# EAGLE design Ver2.1 (EAGLE 9.6.2)
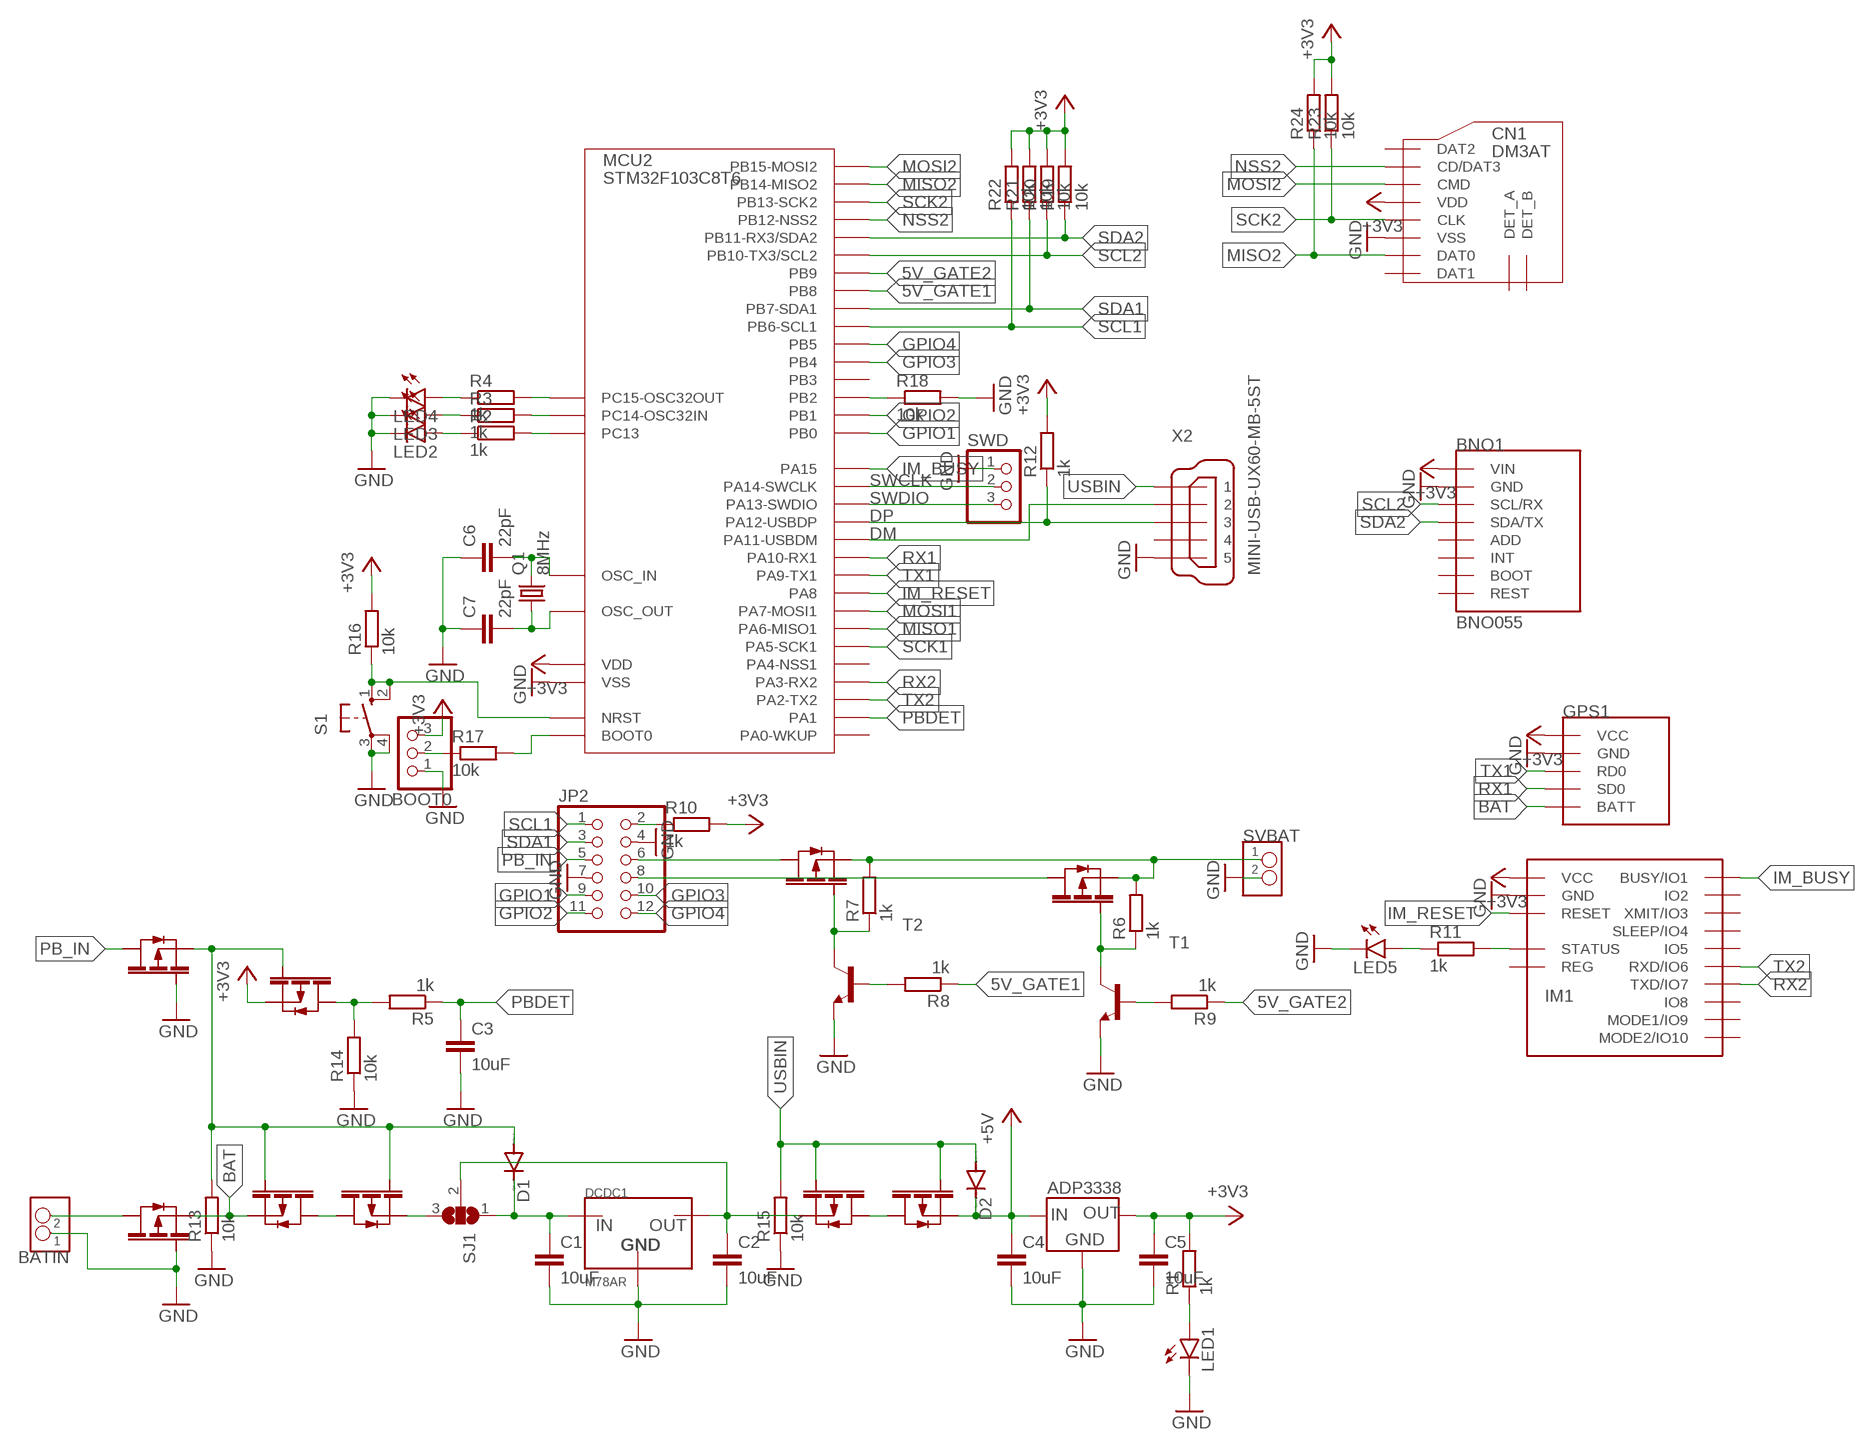
[diagram p0: schematic, sheet 1]

## Parts
BATIN  S2B-XH-A  [S2B-XH-A]
BNO1  BNO055  [BNO055]
BOOT0  PINHD-1X3  [1X03]
C1  10uF  C-EUC2012  [C2012]
C2  10uF  C-EUC2012  [C2012]
C3  10uF  C-EUC2012  [C2012]
C4  10uF  C-EUC2012  [C2012]
C5  10uF  C-EUC2012  [C2012]
C6  22pF  C-EUC2012  [C2012]
C7  22pF  C-EUC2012  [C2012]
CN1  DM3AT  [DM3AT]
D1  DIODE-SOD123  [SOD123]
D2  DIODE-SOD123  [SOD123]
DCDC1  M78AR  [M78AR]
FET1  PCH  [SOT-23]
FET2  PCH  [SOT-23]
FET3  PCH  [SOT-23]
FET4  PCH  [SOT-23]
FET5  PCH  [SOT-23]
FET6  PCH  [SOT-23]
FET7  PCH  [SOT-23]
FET8  PCH  [SOT-23]
FET9  PCH  [SOT-23]
GPS1  GPS-54D  [GPS-54D]
IC1  ADP3338-3.3  [SOT-223]
IM1  IM920C  [IM920C]
JP2  PINHD-2X6  [2X06]
LED1  LEDSMT1206  [1206]
LED2  LEDSMT1206  [1206]
LED3  LEDSMT1206  [1206]
LED4  LEDSMT1206  [1206]
LED5  LEDSMT1206  [1206]
MCU2  STM32F103C8T6  [LQFP48]
Q1  8MHz  CRYSTALHC49S  [HC49/S]
R1  1k  R-EU_R2012  [R2012]
R2  1k  R-EU_R2012  [R2012]
R3  1k  R-EU_R2012  [R2012]
R4  1k  R-EU_R2012  [R2012]
R5  1k  R-EU_R2012  [R2012]
R6  1k  R-EU_R2012  [R2012]
R7  1k  R-EU_R2012  [R2012]
R8  1k  R-EU_R2012  [R2012]
R9  1k  R-EU_R2012  [R2012]
R10  1k  R-EU_R2012  [R2012]
R11  1k  R-EU_R2012  [R2012]
R12  1k  R-EU_R2012  [R2012]
R13  10k  R-EU_R2012  [R2012]
R14  10k  R-EU_R2012  [R2012]
R15  10k  R-EU_R2012  [R2012]
R16  10k  R-EU_R2012  [R2012]
R17  10k  R-EU_R2012  [R2012]
R18  10k  R-EU_R2012  [R2012]
R19  10k  R-EU_R2012  [R2012]
R20  10k  R-EU_R2012  [R2012]
R21  10k  R-EU_R2012  [R2012]
R22  10k  R-EU_R2012  [R2012]
R23  10k  R-EU_R2012  [R2012]
R24  10k  R-EU_R2012  [R2012]
S1  10-XX  [B3F-10XX]
SJ1  SJ2W  [SJ_2]
SVBAT  S2B-XH-A  [S2B-XH-A]
SWD  PINHD-1X3  [1X03]
T1  -NPN-SOT23-EBC  [SOT23-EBC]
T2  -NPN-SOT23-EBC  [SOT23-EBC]
X2  MINI-USB-UX60-MB-5ST  [UX60-MB-5ST]

## Nets
3V3_R_CON [SIGNAL]: JP2.2 R10.1
5V_CL1 [SIGNAL]: R8.2 T2.B
5V_CL2 [SIGNAL]: R9.2 T1.B
5V_FET1_CON [POWER]: FET8.P$3 JP2.6
5V_FET2_CON [POWER]: FET9.P$3 JP2.8
5V_GATE1 [SIGNAL]: MCU2.45(PB8) R8.1
5V_GATE2 [SIGNAL]: MCU2.46(PB9) R9.1
5V_TR1 [SIGNAL]: FET8.P$1 R7.1 T2.C
5V_TR2 [SIGNAL]: FET9.P$1 R6.1 T1.C
+3V3 [POWER]: BNO1.P1(VIN) BOOT0.3 C5.1 CN1.VDD FET5.P$2 GPS1.VCC IC1.1(OUT) IC1.2(OUT) IM1.$P17(VCC) MCU2.1(VDD) MCU2.9(VDD) MCU2.24(VDD) MCU2.36(VDD) MCU2.48(VDD) R1.2 R10.2 R12.2 R16.2 R19.2 R20.2 R21.2 R22.2 R23.2 R24.2
+5V [POWER]: C4.1 D2.C FET7.P$2 IC1.3(IN)
BAT [POWER]: FET2.P$2 FET3.P$2 GPS1.BATT
BAT_CON_FET [POWER]: BATIN.P$2 FET2.P$3
BAT_FET_FET2 [POWER]: FET3.P$3 FET4.P$3
BAT_JMP_DCDC [POWER]: C1.1 D1.C DCDC1.P3(IN) SJ1.1
BOOT0 [SIGNAL]: MCU2.44(BOOT0) R17.2
BOOT0_R_SEL [SIGNAL]: BOOT0.2 R17.1
DCDC_FET [POWER]: C2.1 DCDC1.P1(OUT) FET6.P$2 SJ1.2
DCDC_FET_FET [POWER]: FET6.P$3 FET7.P$3
DM [SIGNAL]: MCU2.32(PA11-USBDM) X2.2
DP [SIGNAL]: MCU2.33(PA12-USBDP) R12.1 X2.3
GND [GND]: BATIN.P$1 BNO1.P2(GND) BOOT0.1 C1.2 C2.2 C3.2 C4.2 C5.2 C6.1 C7.1 CN1.VSS DCDC1.P2(GND) FET1.P$1 FET2.P$1 GPS1.GND IC1.4(GND) IM1.$P18(GND) JP2.4 JP2.7 LED1.C LED2.C LED3.C LED4.C LED5.C MCU2.8(VSS) MCU2.23(VSS) MCU2.35(VSS) MCU2.47(VSS) R13.1 R14.1 R15.1 R18.2 S1.3(P) S1.4(P1) SVBAT.P$2 SWD.1 T1.E T2.E X2.5
GPIO1 [SIGNAL]: JP2.9 MCU2.18(PB0)
GPIO2 [SIGNAL]: JP2.11 MCU2.19(PB1)
GPIO3 [SIGNAL]: JP2.10 MCU2.40(PB4)
GPIO4 [SIGNAL]: JP2.12 MCU2.41(PB5)
IM_BUSY [SIGNAL]: IM1.$P1(BUSY/IO1) MCU2.38(PA15)
IM_RESET [SIGNAL]: IM1.$P19(RESET) MCU2.29(PA8)
IM_STATUS_LED [SIGNAL]: LED5.A R11.1
IM_STATUS_R [SIGNAL]: IM1.$P15(STATUS) R11.2
MISO1 [SIGNAL]: MCU2.16(PA6-MISO1)
MISO2 [SIGNAL]: CN1.DAT0 MCU2.27(PB14-MISO2) R24.1
MOSI1 [SIGNAL]: MCU2.17(PA7-MOSI1)
MOSI2 [SIGNAL]: CN1.CMD MCU2.28(PB15-MOSI2)
NRST [SIGNAL]: MCU2.7(NRST) R16.1 S1.1(S) S1.2(S1)
NSS2 [SIGNAL]: CN1.CD/DAT3 MCU2.25(PB12-NSS2)
OSCI_C [SIGNAL]: C6.2 MCU2.5(OSC_IN) Q1.2
OSCO_C [SIGNAL]: C7.2 MCU2.6(OSC_OUT) Q1.1
PB2_R [SIGNAL]: MCU2.20(PB2) R18.1
PB_FET_DIO [POWER]: D1.A FET1.P$2 FET3.P$1 FET4.P$1 FET5.P$1 R13.2
PB_FET_JMP [POWER]: FET4.P$2 SJ1.3
PB_IN [POWER]: FET1.P$3 JP2.5
PBDET [POWER]: C3.1 MCU2.11(PA1) R5.1
PBDET_FET_R [POWER]: FET5.P$3 R5.2 R14.2
PC13_R [SIGNAL]: MCU2.2(PC13) R2.2
PC13_R_LED [SIGNAL]: LED2.A R2.1
PC14_R [SIGNAL]: MCU2.3(PC14-OSC32IN) R3.2
PC14_R_LED [SIGNAL]: LED3.A R3.1
PC15_R [SIGNAL]: MCU2.4(PC15-OSC32OUT) R4.2
PC15_R_LED [SIGNAL]: LED4.A R4.1
POW_R_LED [SIGNAL]: LED1.A R1.1
RX1 [SIGNAL]: GPS1.SD0 MCU2.31(PA10-RX1)
RX2 [SIGNAL]: IM1.$P7(TXD/IO7) MCU2.13(PA3-RX2)
SCK1 [SIGNAL]: MCU2.15(PA5-SCK1)
SCK2 [SIGNAL]: CN1.CLK MCU2.26(PB13-SCK2) R23.1
SCL1 [SIGNAL]: JP2.1 MCU2.42(PB6-SCL1) R22.1
SCL2 [SIGNAL]: BNO1.P3(SCL/RX) MCU2.21(PB10-TX3/SCL2) R20.1
SDA1 [SIGNAL]: JP2.3 MCU2.43(PB7-SDA1) R21.1
SDA2 [SIGNAL]: BNO1.P4(SDA/TX) MCU2.22(PB11-RX3/SDA2) R19.1
SVBAT_IN [POWER]: FET8.P$2 FET9.P$2 R6.2 R7.2 SVBAT.P$1
SWCLK [SIGNAL]: MCU2.37(PA14-SWCLK) SWD.2
SWDIO [SIGNAL]: MCU2.34(PA13-SWDIO) SWD.3
TX1 [SIGNAL]: GPS1.RD0 MCU2.30(PA9-TX1)
TX2 [SIGNAL]: IM1.$P6(RXD/IO6) MCU2.12(PA2-TX2)
USBIN [POWER]: D2.A FET6.P$1 FET7.P$1 R15.2 X2.1
Unconnected: BNO1.P5(ADD) BNO1.P6(INT) BNO1.P7(BOOT) BNO1.P8(REST) CN1.DAT1 CN1.DAT2 CN1.DET_A CN1.DET_B IM1.$P2(IO2) IM1.$P3(XMIT/IO3) IM1.$P4(SLEEP/IO4) IM1.$P5(IO5) IM1.$P8(IO8) IM1.$P9(MODE1/IO9) IM1.$P10(MODE2/IO10) IM1.$P16(REG) MCU2.10(PA0-WKUP) MCU2.14(PA4-NSS1) MCU2.39(PB3) X2.4

## Library data of the parts
BATIN SVBAT = JST-Con:S2B-XH-A
BNO1 = BNO055:BNO055
BOOT0 SWD = pinhead:PINHD-1X3: PIN HEADER
C1-C7 = rcl:C-EU: CAPACITOR, European symbol; SPICEPREFIX: C
CN1 = microSD:DM3AT
D1 D2 = diode:DIODE-: DIODE
DCDC1 = M78AR:M78AR
FET1-FET9 = MOSFET:PCH
GPS1 = GPS-54D:GPS-54D
IC1 = ADP3338:ADP3338-3.3
IM1 = IM920:IM920C
JP2 = pinhead:PINHD-2X6: PIN HEADER
LED1-LED5 = led:LED: LED OSRAM: - CHIPLED LG R971, LG N971, LY N971, LG Q971, LY Q971, LO R971, LY R971 LH N974, LH R974 LS Q976, LO Q976, LY Q976 LO Q996 - Hyper CHIPLED LW Q18S LB Q993, LB Q99A, LB R99A - SideLED LS A670, LO A670, LY A670, LG A670, LP A670 LB A673, LV A673, LT A673, LW A673 LH A674 LY A675 LS A676, LA A676, LO A676, LY A676, LW A676 LS A679, LY A679, LG A679 - Hyper Micro SIDELED® LS Y876, LA Y876, LO Y876, LY Y876 LT Y87S - SmartLED LW L88C, LW L88S LB L89C, LB L89S, LG L890 LS L89K, LO L89K, LY L89K LS L896, LA L896, LO L896, LY L896 - TOPLED LS T670, LO T670, LY T670, LG T670, LP T670 LSG T670, LSP T670, LSY T670, LOP T670, LYG T670 LG T671, LOG T671, LSG T671 LB T673, LV T673, LT T673, LW T673 LH T674 LS T676, LA T676, LO T676, LY T676, LB T676, LH T676, LSB T676, LW T676 LB T67C, LV T67C, LT T67C, LS T67K, LO T67K, LY T67K, LW E67C LS E67B, LA E67B, LO E67B, LY E67B, LB E67C, LV E67C, LT E67C LW T67C LS T679, LY T679, LG T679 LS T770, LO T770, LY T770, LG T770, LP T770 LB T773, LV T773, LT T773, LW T773 LH T774 LS E675, LA E675, LY E675, LS T675 LS T776, LA T776, LO T776, LY T776, LB T776 LHGB T686 LT T68C, LB T68C - Hyper Mini TOPLED® LB M676 - Mini TOPLED Santana® LG M470 LS M47K, LO M47K, LY M47K Source: http://www.osram.convergy.de LUXEON: - LUMILED® LXK2-PW12-R00, LXK2-PW12-S00, LXK2-PW14-U00, LXK2-PW14-V00 LXK2-PM12-R00, LXK2-PM12-S00, LXK2-PM14-U00 LXK2-PE12-Q00, LXK2-PE12-R00, LXK2-PE12-S00, LXK2-PE14-T00, LXK2-PE14-U00 LXK2-PB12-K00, LXK2-PB12-L00, LXK2-PB12-M00, LXK2-PB14-N00, LXK2-PB14-P00, LXK2-PB14-Q00 LXK2-PR12-L00, LXK2-PR12-M00, LXK2-PR14-Q00, LXK2-PR14-R00 LXK2-PD12-Q00, LXK2-PD12-R00, LXK2-PD12-S00 LXK2-PH12-R00, LXK2-PH12-S00 LXK2-PL12-P00, LXK2-PL12-Q00, LXK2-PL12-R00 Source: www.luxeon.com KINGBRIGHT: KA-3528ASYC Source: www.kingbright.com
MCU2 = STM32F103C8T6:STM32F103C8T6
Q1 = crystal:CRYSTAL: CRYSTAL; OC_FARNELL: 1667008; OC_NEWARK: unknown
R1-R24 = rcl:R-EU_: RESISTOR, European symbol; SPICEPREFIX: R
S1 = switch-omron:10-XX: OMRON SWITCH; MPN: B3F-1000; OC_FARNELL: 176432; OC_NEWARK: 36M3542
SJ1 = jumper:SJ2W: SMD solder JUMPER
T1 T2 = transistor:*-NPN-: NPN Transistror BF959 corrected 2008.03.06
X2 = con-hirose:MINI-USB-: MINI USB Connector Source: http://www.hirose.co.jp/cataloge_hp/e24000019.pdf; OC_FARNELL: unknown; OC_NEWARK: unknown

## Net classes
1 SIGNAL: width 0.152 mm, drill 0.305 mm, clearance 0.152 mm
2 GND: width 0.305 mm, drill 0.305 mm, clearance 0.152 mm
3 POWER: width 0.381 mm, drill 0.305 mm, clearance 0.152 mm

## Board
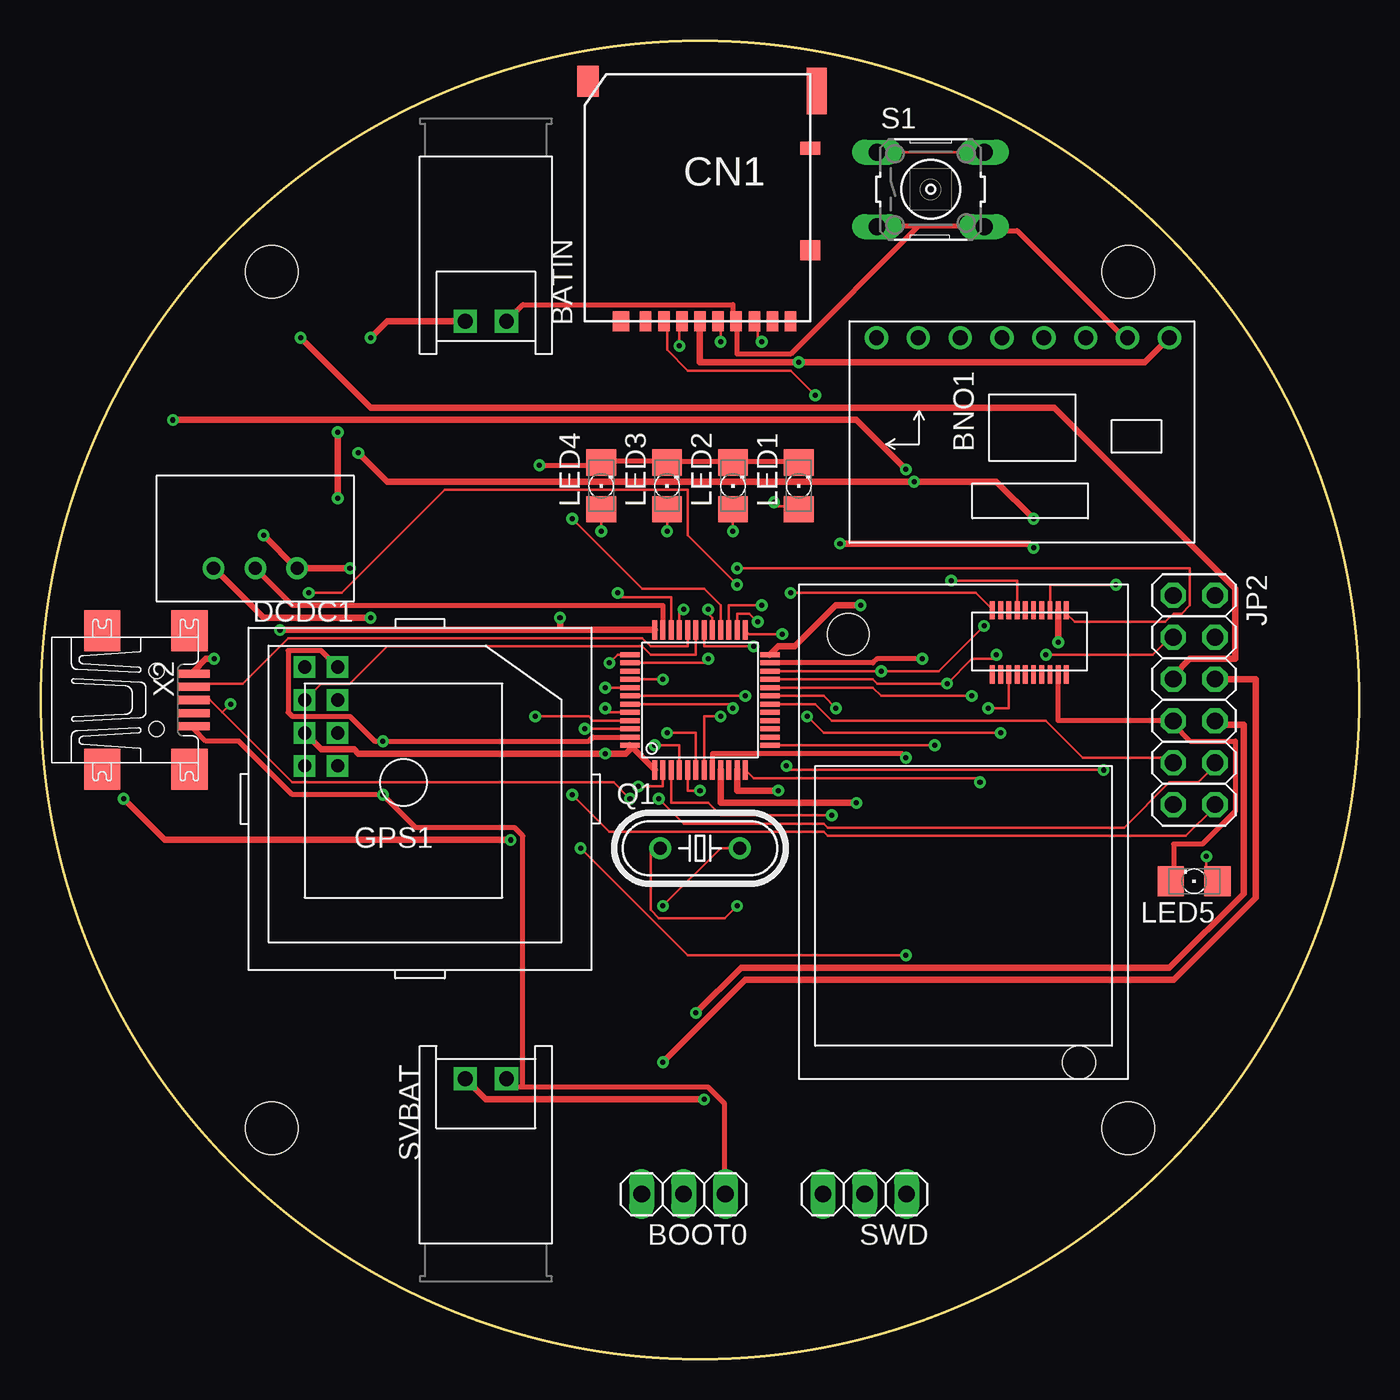
[diagram p1: board, top side]
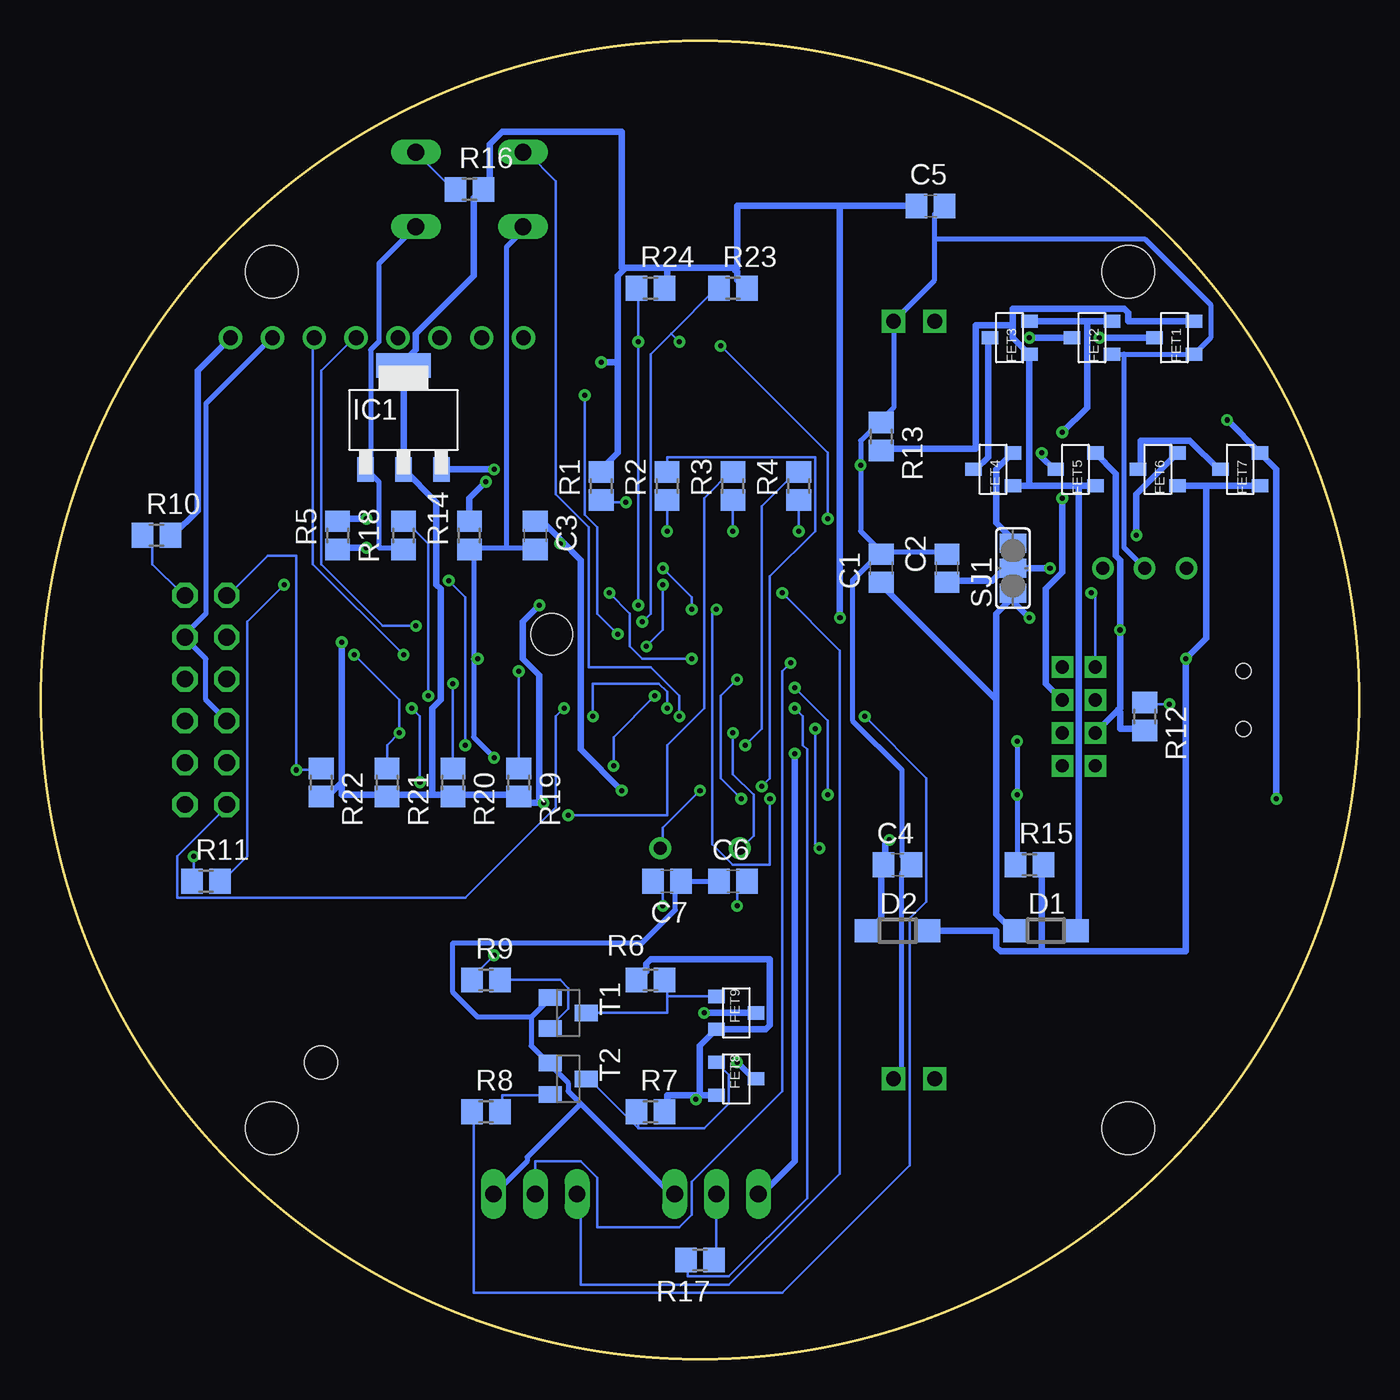
[diagram p2: board, bottom side, seen from below]

Size 80 x 80 mm. Coordinates in mm from the lower left corner, seen from the top.
Outline: circle at 40,40 radius 40
Copper layers (1*16): Top 0.035mm / dielectric 1.5mm / Bottom 0.035mm
Design rules "PCBGoGo": minimum track width 6mil, minimum drill 0.2mm, track to track 6mil, track to pad 6mil, pad to pad 6mil, via to via 6mil, smd to smd 6mil, copper to edge 0.2mm, drill to drill 6mil, minimum pad ring 10mil, minimum via ring 8mil, stop-mask expansion 4mil, vias tented up to drill 0mil, thermal gap 10mil
Holes 3.2 mm at 66,66 14,66 14,14 66,14

### Footprints (pad centres in the part's own frame; a part is rotated, then mirrored left to right if it is on the bottom)
S2B-XH-A = drill 0.9 square: P$1 0,1.25; P$2 0,-1.25
BNO055 = drill 0.9: P1 -7,11.5; P2 -7,8.96; P3 -7,6.42; P4 -7,3.88; P5 -7,1.34; P6 -7,-1.2; P7 -7,-3.74; P8 -7,-6.28
1X03 = drill 1.016 long: 1 -2.54,0; 2 0,0; 3 2.54,0
C2012 = smd 1.3 x 1.5: 1 -0.85,0; 2 0.85,0
DM3AT = smd 0.7 x 1.2: CD/DAT3 2.2,6; CLK -1.1,6; CMD 1.1,6; DAT0 -3.3,6; DAT1 -4.4,6; DAT2 3.3,6; DET_B -5.5,6; VDD 0,6; VSS -2.2,6 | smd 1.2 x 0.8: DET_A -6.7,-4.5 | smd 1 x 1.2: P$9 4.8,6 | smd 1.2 x 1.2: P$11 -6.7,1.7 | smd 1.2 x 2.8: P$13 -7.081,-7.973 | smd 1.3 x 1.9: P$14 6.8,-8.562
SOD123 = smd 1.4 x 1.4: A 1.9,0; C -1.9,0
M78AR = drill 0.8: P1 -2.54,0; P2 0,0; P3 2.54,0
SOT-23 = smd 0.8 x 1: P$1 -1,0; P$2 1,0; P$3 0,2.4
GPS-54D = drill 0.8 square: BATT -5,6; GND -5,8; NC1 -5,4; NC2 -7,2; NC3 -5,2; RD0 -7,8; SD0 -7,6; VCC -7,4
SOT-223 = smd 3.3 x 1.5: 1 0,3.3 | smd 1 x 1.5: 2 0,-3; 3 2.3,-3; 4 -2.3,-3
IM920C = smd 0.3 x 1.1: $P1 -1.75,-13.45; $P2 -1.75,-9.55; $P3 -2.25,-13.45; $P4 -2.25,-9.55; $P5 -2.75,-13.45; $P6 -2.75,-9.55; $P7 -3.25,-13.45; $P8 -3.25,-9.55; $P9 -3.75,-13.45; $P10 -3.75,-9.55; $P11 -4.25,-13.45; $P12 -4.25,-9.55; $P13 -4.75,-13.45; $P14 -4.75,-9.55; $P15 -5.25,-13.45; $P16 -5.25,-9.55; $P17 -5.75,-13.45; $P18 -5.75,-9.55; $P19 -6.25,-13.45; $P20 -6.25,-9.55 | hole 2.5: 7,-12 | hole 2: -7,14
2X06 = drill 1.016 octagon: 1 -6.35,-1.27; 2 -6.35,1.27; 3 -3.81,-1.27; 4 -3.81,1.27; 5 -1.27,-1.27; 6 -1.27,1.27; 7 1.27,-1.27; 8 1.27,1.27; 9 3.81,-1.27; 10 3.81,1.27; 11 6.35,-1.27; 12 6.35,1.27
1206 = smd 1.6 x 1.803: A -1.422,0; C 1.422,0
LQFP48 = smd 0.3 x 1.2: 1 -2.75,-4.25; 2 -2.25,-4.25; 3 -1.75,-4.25; 4 -1.25,-4.25; 5 -0.75,-4.25; 6 -0.25,-4.25; 7 0.25,-4.25; 8 0.75,-4.25; 9 1.25,-4.25; 10 1.75,-4.25; 11 2.25,-4.25; 12 2.75,-4.25; 25 2.75,4.25; 26 2.25,4.25; 27 1.75,4.25; 28 1.25,4.25; 29 0.75,4.25; 30 0.25,4.25; 31 -0.25,4.25; 32 -0.75,4.25; 33 -1.25,4.25; 34 -1.75,4.25; 35 -2.25,4.25; 36 -2.75,4.25 | smd 1.2 x 0.3: 13 4.25,-2.75; 14 4.25,-2.25; 15 4.25,-1.75; 16 4.25,-1.25; 17 4.25,-0.75; 18 4.25,-0.25; 19 4.25,0.25; 20 4.25,0.75; 21 4.25,1.25; 22 4.25,1.75; 23 4.25,2.25; 24 4.25,2.75; 37 -4.25,2.75; 38 -4.25,2.25; 39 -4.25,1.75; 40 -4.25,1.25; 41 -4.25,0.75; 42 -4.25,0.25; 43 -4.25,-0.25; 44 -4.25,-0.75; 45 -4.25,-1.25; 46 -4.25,-1.75; 47 -4.25,-2.25; 48 -4.25,-2.75
HC49/S = drill 0.813: 1 -2.413,0; 2 2.413,0
R2012 = smd 1.3 x 1.5: 1 -0.85,0; 2 0.85,0
B3F-10XX = drill 1.016 long: 1 -3.251,2.261; 2 3.251,2.261; 3 -3.251,-2.261; 4 3.251,-2.261
SJ_2 = smd 1.168 x 1.6: 1 -1.524,0; 2 0,0; 3 1.524,0
SOT23-EBC = smd 1 x 1.4: B 0.95,-1.1; C 0,1.1; E -0.95,-1.1
UX60-MB-5ST = smd 2 x 0.5: 1 2.25,1.6; 2 2.25,0.8; 3 2.25,0; 4 2.25,-0.8; 5 2.25,-1.6 | smd 2.2 x 2.5: M1 -3.3,-4.2; M2 -3.3,4.2; M3 2,4.2; M4 2,-4.2 | hole 0.9: 0,-1.75; 0,1.75

### Placement (x,y rotation side)
BATIN  27,63 270 top
BNO1  57,55 270 top
BOOT0  39,10 180 top
C1  29,48 90 bottom
C2  25,48 90 bottom
C3  50,50 270 bottom
C4  28,30 0 bottom
C5  26,70 0 bottom
C6  38,29 0 bottom
C7  42,29 180 bottom
CN1  40,69 180 top
D1  19,26 0 bottom
D2  28,26 0 bottom
DCDC1  13,48 180 top
FET1  10,62 90 bottom
FET2  15,62 90 bottom
FET3  20,62 90 bottom
FET4  21,54 90 bottom
FET5  16,54 90 bottom
FET6  11,54 90 bottom
FET7  6,54 90 bottom
FET8  39,17 270 bottom
FET9  39,21 270 bottom
GPS1  23,34 0 top
IC1  58,57 0 bottom
IM1  56,32 180 top
JP2  70,40 270 top
LED1  46,53 90 top
LED2  42,53 90 top
LED3  38,53 90 top
LED4  34,53 90 top
LED5  70,29 180 top
MCU2  40,40 0 top
Q1  40,31 0 top
R1  46,53 90 bottom
R2  42,53 90 bottom
R3  38,53 90 bottom
R4  34,53 90 bottom
R5  62,50 90 bottom
R6  43,23 180 bottom
R7  43,15 0 bottom
R8  53,15 0 bottom
R9  53,23 0 bottom
R10  73,50 0 bottom
R11  70,29 0 bottom
R12  13,39 270 bottom
R13  29,56 270 bottom
R14  54,50 90 bottom
R15  20,30 0 bottom
R16  54,71 0 bottom
R17  40,6 180 bottom
R18  58,50 270 bottom
R19  51,35 270 bottom
R20  55,35 270 bottom
R21  59,35 270 bottom
R22  63,35 270 bottom
R23  38,65 0 bottom
R24  43,65 0 bottom
S1  54,71 0 top
SJ1  21,48 90 bottom
SVBAT  27,17 90 top
SWD  50,10 180 top
T1  48,21 270 bottom
T2  48,17 270 bottom
X2  7,40 0 top

### Tracks (layer width: path | path; a pad name or v marks a point on that pad's centre or on a via)
3V3_R_CON
  Bottom 0.152: R10.1 73.75,50 73.25,49.5 73.25,48.25 71.5,46.5 JP2.2
5V_CL1
  Bottom 0.152: T2.B 49.25,16 52,16 52,15 R8.2
5V_CL2
  Bottom 0.152: R9.2 48.5,23 48,22.5 48,21.25 49,20.25 T1.B
5V_FET1_CON  (via drill 0.3)
  Top 0.381: v37.75,18 42.75,23 68.75,23 73.75,28 73.75,41.25 71.5,41.25 JP2.6
  Bottom 0.381: v37.75,18 36.75,17 FET8.P$3
5V_FET2_CON  (via drill 0.3)
  Top 0.381: v39.75,21 42.5,23.75 68.5,23.75 73,28.25 73,38.5 71.5,38.5 JP2.8
  Bottom 0.381: v39.75,21 FET9.P$3
5V_GATE1  (via drill 0.3)
  Top 0.152: MCU2.45 33.5,38.75 33.25,39 v30,39
  Bottom 0.152: v30,39 26.25,35.25 26.25,27.75 27.25,26.75 27.25,11.75 35,4 53.75,4 53.75,15 R8.1
5V_GATE2  (via drill 0.3)
  Top 0.152: v33,38.25 MCU2.46 | v32.75,31 39.25,24.5 v52.5,24.5
  Bottom 0.152: v33,38.25 33,31.25 v32.75,31 | v52.5,24.5 53.75,23.25 53.75,23 R9.1
5V_TR1
  Bottom 0.152: FET8.P$1 38.25,17.25 38.25,15.5 39.75,14 43.75,14 | 43.75,14 43.75,15 R7.1 | 43.75,14 46.75,17 T2.C
5V_TR2
  Bottom 0.152: 42,22 FET9.P$1 | 42,22 42,23 R6.1 | T1.C 42,21 42,22
+3V3  (via drill 0.3)
  Top 0.381: MCU2.48 35.88,37.12 | 35.88,37.12 MCU2.1 | v14.5,44.25 31.5,44.25 | 31.5,44.25 MCU2.36 | 35.88,37.12 35.5,36.75 v34.25,36.75 19.25,36.75 19,37 17,37 GPS1.VCC | CN1.VDD 40,60.5 v46,60.5 67,60.5 BNO1.P1 | v61.75,43.5 IM1.$P17 | MCU2.9 41.25,33.75 v49.5,33.75 | MCU2.24 44.75,43.25 45.75,43.25 48.25,45.75 v49.75,45.75 | v31.5,45 31.5,44.25
  Bottom 0.381: FET5.P$2 14.75,53.75 14.75,48.75 14.5,48.5 v14.5,44.25 14.5,39.5 14.62,39.38 | GPS1.VCC 14.62,39.38 | R12.2 13,38.25 14.5,38.25 14.5,39.25 14.62,39.38 | v34.25,36.75 34.25,12 36.25,10 BOOT0.3 | BNO1.P1 70.5,60 70.5,51.5 72,50 R10.2 | v61.75,43.5 61.75,35 61.88,34.88 | 61.88,34.88 62.5,34.25 63,34.25 R22.2 | 59,34.25 61.75,34.25 61.75,34.75 61.88,34.88 | 49.75,33.75 51,33.75 R19.2 51,34.25 55,34.25 | v49.75,45.75 50.75,44.75 50.75,42.5 49.75,41.5 49.75,33.75 | 49.75,33.75 v49.5,33.75 | 55,34.25 56.25,34.25 | 56.25,34.25 59,34.25 | 59,34.25 R21.2 | 55,34.25 R20.2 | 37.88,66.12 38,66.25 42,66.25 | 37.88,66.12 37.75,66 37.75,65.5 37.25,65 R23.2 | 42,66.25 42,65 R24.2 | 31.5,70 37.75,70 37.75,66.25 37.88,66.12 | 31.5,70 C5.1 | 45,60.5 45,65.75 44.62,66.12 | 45,60.5 45,55 46,54 R1.2 | 44.62,66.12 44.5,66.25 42,66.25 | 44.62,66.12 44.75,66.25 44.75,74.5 52,74.5 52.75,73.75 52.75,71.25 53,71 R16.2 53.25,71 53.75,70.5 53.75,65.75 57.25,62.25 57.25,61.25 58,60.5 IC1.1 IC1.2 56,52 56,47 55.75,46.75 55.75,40 56.25,39.5 56.25,34.25 | 45,60.5 v46,60.5 | 31.5,70 v31.5,45
+5V  (via drill 0.3)
  Top 0.381: v5,34 7.5,31.5 v28.5,31.5 | v52.5,54 49.5,57 v8,57
  Bottom 0.381: v5,34 5,54 FET7.P$2 v8,57 | v28.5,31.5 28.75,31.25 28.75,30 C4.1 29,30 29,26.75 29.75,26 D2.C | v52.5,54 IC1.3
BAT  (via drill 0.3)
  Top 0.381: v18,56.25 v18,52.25
  Bottom 0.381: FET3.P$2 16.5,63 | 16.5,63 FET2.P$2 | GPS1.BATT 19,41 19,46.75 18,47.75 v18,52.25 | v18,56.25 16.5,57.75 16.5,63
BAT_CON_FET  (via drill 0.3)
  Top 0.381: v20,62 21,63 BATIN.P$2
  Bottom 0.381: v20,62 FET2.P$3
BAT_FET_FET2
  Bottom 0.381: FET4.P$3 23.25,54 22.5,54.75 22.5,62 FET3.P$3
BAT_JMP_DCDC  (via drill 0.3)
  Top 0.381: v20,45 13.5,45 10.5,48 DCDC1.P3
  Bottom 0.381: 22,40 22,45.25 21,46.25 SJ1.1 21,46 v20,45 | 22,40 22,27 21,26 D1.C | 22,40 29,47 C1.1
BOOT0  (via drill 0.3)
  Top 0.152: MCU2.44 34.5,39.25 v34.25,39.5
  Bottom 0.152: v34.25,39.5 33.75,39 33.75,37.25 33.5,37 33.5,9.75 38.25,5 40.75,5 40.75,6 R17.2
BOOT0_R_SEL
  Bottom 0.152: BOOT0.2 39,6 R17.1
DCDC_FET  (via drill 0.3)
  Top 0.381: v13.5,50 15.5,48 DCDC1.P1 v18.75,48
  Bottom 0.381: C2.1 25,47.25 22.25,47.25 21.5,48 SJ1.2 v18.75,48 | FET6.P$2 13.5,52.5 v13.5,50
DCDC_FET_FET
  Bottom 0.381: FET7.P$3 8.5,54 10.25,55.75 13.25,55.75 13.25,54 FET6.P$3
DM
  Top 0.152: MCU2.32 39.25,43.25 37,43.25 36.5,43.75 15,43.75 12.25,41 9.25,41 X2.2
DP  (via drill 0.3)
  Top 0.152: MCU2.33 38.75,45.5 v39,45.5 | v35.75,34 34.75,35 15.25,35 11,39.25 | 11,39.25 10.25,40 X2.3 | 11,39.25 v11.5,39.75
  Bottom 0.152: v39,45.5 39.25,45.25 39.25,31.25 38,30 35.75,30 v35.75,34 | v11.5,39.75 13,39.75 R12.1
GND  (via drill 0.3)
  Top 0.305: MCU2.47 33.5,37.75 33.25,37.5 v20.75,37.5 20.25,37.5 18.75,39 15.25,39 15,39.25 15,43 17,43 GPS1.GND | X2.5 9.25,38.25 10,37.5 12,37.5 15.25,34.25 v20.75,34.25 22.75,32.25 28.75,32.25 29.25,31.75 29.25,16.5 | SVBAT.P$2 28.75,16.5 29.25,16.5 | 29.25,16.5 40.5,16.5 41.5,15.5 41.5,10 BOOT0.1 | MCU2.35 37.75,45.75 15.25,45.75 DCDC1.P2 | 38,54.5 34,54.5 LED4.C 34,54.25 v30.25,54.25 | 38,54.5 42,54.5 | 38,54.5 LED3.C | 42,54.5 46,54.5 LED1.C | 42,54.5 LED2.C | BATIN.P$1 29.25,64 42,64 42,63 CN1.VSS 42.25,63 42.25,61 45.5,61 53.25,68.75 | IM1.$P18 61.75,38.75 68.5,38.75 JP2.7 68.75,38.5 69.75,37.5 72.5,37.5 72.5,33.25 70.5,31.25 68.75,31.25 68.75,29 LED5.C | MCU2.8 40.75,36.75 52.25,36.75 v52.5,36.5 | MCU2.23 50.5,42.25 50.75,42.5 v53.5,42.5 | BNO1.P2 65.75,62 59.25,68.5 57.5,68.5 S1.4 53.25,68.75 | 53.25,68.75 S1.3
  Bottom 0.305: v20.75,37.5 v20.75,34.25 20.75,30 R15.1 | 27.25,30 27.75,29.5 27.75,17.5 SVBAT.P$2 | C6.1 C7.1 41.25,29 41.5,28.75 41.5,27.25 43.5,25.25 55,25.25 55,22.25 53.5,20.75 50.25,20.75 | 50.25,20.75 50.25,19 49.25,18 T2.E 49,17.75 48,16.75 48,16.25 47.25,15.5 | 50.25,20.75 49.25,21.75 T1.E | 47.25,15.5 41.75,10 BOOT0.1 | 47.25,15.5 50.5,12.25 50.5,12 52.5,10 SWD.1 | FET2.P$1 14.25,61 | 14.25,61 FET1.P$1 9,62 9,64 13,68 25.75,68 | 14.25,61 14.25,49.25 DCDC1.P2 | 29,49 25,49 C2.2 | 29,57 28.25,57.75 BATIN.P$1 25.75,65.5 25.75,68 | 25.75,68 25.75,69.5 25.25,70 C5.2 | 29,49 30.25,50.25 v30.25,54.25 30.25,55.75 29,57 | 29,57 R13.1 | JP2.7 70,40 70,42.5 71.25,43.75 JP2.4 71.25,44 70,45.25 70,58 66,62 BNO1.P2 | v52.5,36.5 53.75,37.75 53.75,42.5 | 53.75,42.5 53.75,48.75 54,49 R14.1 54,49.25 51.75,49.25 | 53.75,42.5 v53.5,42.5 | 51.75,49.25 50,49.25 C3.2 | 60.25,54 59.5,53.25 59.5,49.25 58,49.25 R18.2 | 60.25,54 60,54.25 60,61.25 59.5,61.75 59.5,66.5 57.5,68.5 S1.4 | 60.25,54 IC1.4 | 51.75,49.25 51.75,67.5 50.75,68.5 S1.3 | 27.25,30 27.75,30.5 27.75,35.75 30.75,38.75 30.75,47.25 29,49 | 27.25,30 C4.2 | 29,49 C1.2
GPIO1
  Top 0.152: MCU2.18 47,39.75 48,38.75 61,38.75 63.25,36.5 68.25,36.5 68.5,36.25 JP2.9
GPIO2  (via drill 0.3)
  Top 0.152: MCU2.19 47.5,40.25 v48.25,39.5
  Bottom 0.152: v48.25,39.5 48.75,39 48.75,33.5 54.25,28 71.75,28 71.75,30.5 68.75,33.5 JP2.11
GPIO3  (via drill 0.3)
  Top 0.152: v37.75,41.25 MCU2.40 | v37.5,34 39,32.5 47.5,32.5 47.75,32.25 65.75,32.25 68.5,35 70.25,35 71.25,36 JP2.10
  Bottom 0.152: v37.75,41.25 38.75,40.25 38.75,35.25 v37.5,34
GPIO4  (via drill 0.3)
  Top 0.152: v34.25,40.75 MCU2.41 | v32.25,34.25 34.5,32 47.5,32 47.75,31.75 69.5,31.75 71.25,33.5 JP2.12
  Bottom 0.152: v34.25,40.75 32.25,38.75 v32.25,34.25
IM_BUSY  (via drill 0.3)
  Top 0.152: v45.5,46.5 56.75,46.5 57.75,45.5 IM1.$P1 | v40.5,42.5 40.25,42.25 MCU2.38
  Bottom 0.152: v45.5,46.5 44.25,45.25 44.25,43.25 43.5,42.5 v40.5,42.5
IM_RESET  (via drill 0.3)
  Top 0.152: v42.25,48 69.75,48 69.75,45.75 69.25,45.25 68.75,45.25 68.25,44.75 62.75,44.75 62.25,45.25 IM1.$P19 | v40.5,45.5 40.5,45.25 40.75,45 MCU2.29
  Bottom 0.152: v42.25,48 40.5,46.25 v40.5,45.5
IM_STATUS_LED  (via drill 0.3)
  Top 0.152: v70.75,30.5 70.75,29 LED5.A
  Bottom 0.152: v70.75,30.5 70.75,29 R11.1
IM_STATUS_R  (via drill 0.3)
  Top 0.152: IM1.$P15 61.25,47 v65.25,47
  Bottom 0.152: v65.25,47 67.5,44.75 67.5,30.5 69,29 R11.2
MISO2  (via drill 0.3)
  Top 0.152: MCU2.27 41.75,45.75 v43.75,45.75 | v43.75,61.75 43.5,61.75 43.5,63 CN1.DAT0
  Bottom 0.152: v43.75,45.75 v43.75,61.75 43.75,65 R24.1
MOSI2  (via drill 0.3)
  Top 0.152: v38.75,61.5 38.75,63 CN1.CMD | v32.25,51 36.5,46.75 40.25,46.75 41.25,45.75 MCU2.28
  Bottom 0.152: v38.75,61.5 32.25,55 v32.25,51
NRST  (via drill 0.3)
  Top 0.152: MCU2.7 40.25,39 v41.25,39 | S1.2 S1.1
  Bottom 0.152: R16.1 55,71 S1.2 | v41.25,39 41.25,40.25 43,42 46.75,42 46.75,50.5 48.75,52.5 48.75,71.5 50.5,73.25 S1.1
NSS2  (via drill 0.3)
  Top 0.152: MCU2.25 43,44 v45,44 | v47,58.5 45.5,60 39.25,60 38,61.25 38,63 CN1.CD/DAT3
  Bottom 0.152: v45,44 46.25,45.25 46.25,50.5 47,51.25 v47,58.5
OSCI_C  (via drill 0.3)
  Top 0.152: MCU2.5 39.25,34.5 v40,34.5 | v37.75,27.5 41.25,31 Q1.2
  Bottom 0.152: v40,34.5 42.25,32.25 42.25,31 Q1.2 | v37.75,27.5 37.75,28.5 37.25,29 C6.2
OSCO_C  (via drill 0.3)
  Top 0.152: MCU2.6 39.75,38 v38,38 | v42.25,27.5 41.5,26.75 37.5,26.75 37,27.25 37,31 Q1.1
  Bottom 0.152: v38,38 38,35.5 36.75,34.25 36.75,31.75 37.5,31 Q1.1 | v42.25,27.5 42.25,28.5 42.75,29 C7.2
PB2_R  (via drill 0.3)
  Top 0.152: MCU2.20 50.5,40.75 51,40.25 v56.5,40.25
  Bottom 0.152: v56.5,40.25 56.5,49.5 58,51 R18.1
PB_FET_DIO
  Bottom 0.381: FET4.P$1 20,53 | 20,53 17,53 | 17,53 FET5.P$1 | 20,53 FET3.P$1 21,62 21,62.75 | FET1.P$2 14,63 14,63.5 14.25,63.75 21,63.75 21,62.75 | 17,53 17,26 D1.A | 21,62.75 23.25,62.75 23.25,55.25 29,55.25 R13.2
PB_FET_JMP
  Bottom 0.381: FET4.P$2 22,54 22,50.75 21,49.75 SJ1.3
PB_IN  (via drill 0.3)
  Top 0.381: v15.75,62 20,57.75 61.5,57.75 72.5,46.75 72.5,42.5 69.75,42.5 68.75,41.5 JP2.5
  Bottom 0.381: v15.75,62 FET1.P$3
PBDET  (via drill 0.3)
  Top 0.381: MCU2.11 42.25,34.5 v44.75,34.5 | v60.25,49.25 60,49.5 v48.5,49.5
  Bottom 0.381: v44.75,34.5 47.25,37 47.25,48.5 48.38,49.62 | 48.38,49.62 49.5,50.75 50,50.75 C3.1 | v60.25,49.25 62,49.25 R5.1 | v48.5,49.5 48.38,49.62
PBDET_FET_R  (via drill 0.3)
  Top 0.381: v19.25,55 21,53.25 v53,53.25 58,53.25 v60.25,51
  Bottom 0.381: v19.25,55 19.25,54.75 18.5,54 FET5.P$3 | v53,53.25 54,52.25 R14.2 | v60.25,51 62,51 R5.2
PC13_R  (via drill 0.3)
  Top 0.152: MCU2.2 37.75,34.75 v36.25,34.75
  Bottom 0.152: v36.25,34.75 35.75,35.25 35.75,47.5 33,50.25 33,54.75 42,54.75 R2.2
PC13_R_LED  (via drill 0.3)
  Top 0.152: LED2.A v42,50.25
  Bottom 0.152: v42,50.25 R2.1
PC14_R  (via drill 0.3)
  Top 0.152: MCU2.3 38.25,33.75 40.5,33.75 41.25,33 v48,33
  Bottom 0.152: v48,33 42,33 42,37.25 39.75,39.5 39.75,52.25 38,54 R3.2
PC14_R_LED  (via drill 0.3)
  Top 0.152: LED3.A v38,50.25
  Bottom 0.152: v38,50.25 R3.1
PC15_R  (via drill 0.3)
  Top 0.152: MCU2.4 38.75,37.25 v37.25,37.25
  Bottom 0.152: v37.25,37.25 36.25,38.25 36.25,51.75 34,54 R4.2
PC15_R_LED  (via drill 0.3)
  Top 0.152: LED4.A v34,50.25
  Bottom 0.152: v34,50.25 R4.1
POW_R_LED  (via drill 0.3)
  Top 0.152: v44.5,52 44.75,51.75 46,51.75 LED1.A
  Bottom 0.152: v44.5,52 46,52 R1.1
RX1
  Top 0.152: MCU2.31 39.75,42.75 37,42.75 36.5,43.25 21,43.25 18.75,41 17,41 GPS1.SD0
RX2  (via drill 0.3)
  Top 0.152: IM1.$P7 59.25,47.25 v55.25,47.25 | MCU2.13 v54.25,37.25
  Bottom 0.152: v55.25,47.25 54.25,46.25 v54.25,37.25
SCK2  (via drill 0.3)
  Top 0.152: MCU2.26 42.25,45.25 43,45.25 v43.5,44.75 | v41.25,61.75 41.25,63 CN1.CLK
  Bottom 0.152: v43.5,44.75 43,45.25 43,61 41.75,62.25 | 41.75,62.25 39,65 R23.1 | 41.75,62.25 v41.25,61.75
SCL1  (via drill 0.3)
  Top 0.152: v42.75,40.25 MCU2.42 | v45.25,36 45.5,35.75 v64.5,35.75
  Bottom 0.152: v42.75,40.25 45.25,37.75 v45.25,36 | R22.1 63,35.75 v64.5,35.75 64.5,48.75 66.25,48.75 68.5,46.5 JP2.1
SCL2  (via drill 0.3)
  Top 0.152: MCU2.21 50.5,41.25 50.75,41 v55,41 56.5,42.5 57.75,42.5 v58,42.75
  Bottom 0.152: R20.1 v55,41 | v58,42.75 63.5,48.25 63.5,62 BNO1.P3
SDA1  (via drill 0.3)
  Top 0.152: MCU2.43 41.75,39.75 v42,39.5 | v46.5,39 47.5,38 v58.25,38 | v61,42.75 67.5,42.75 68.5,43.75 JP2.3
  Bottom 0.152: v42,39.5 42,40.5 42.5,41 46.5,41 v46.5,39 | R21.1 59,37.25 v58.25,38 58.25,40 v61,42.75
SDA2  (via drill 0.3)
  Top 0.152: MCU2.22 v51,41.75 54.5,41.75 v57.25,44.5
  Bottom 0.152: R19.1 v51,41.75 | v57.25,44.5 59.25,44.5 63,48.25 63,60 61,62 BNO1.P4
SVBAT_IN  (via drill 0.3)
  Top 0.381: SVBAT.P$1 27,15.75 v40.25,15.75
  Bottom 0.381: 40.25,16 42,16 42,15 R7.2 | 40.25,16 40,16 | 40,16 FET8.P$2 | 40,16 40,19 FET9.P$2 36,20 35.75,20.25 35.75,24.25 43,24.25 43.25,24 43.25,23.5 43.75,23 R6.2 | 40.25,16 v40.25,15.75
SWCLK  (via drill 0.3)
  Top 0.152: MCU2.37 35,42.75 v34.5,42.25
  Bottom 0.152: v34.5,42.25 35,41.75 35,16.25 40.5,10.75 40.5,8.75 41.25,8 46.25,8 46.25,11 47.25,12 50,12 SWD.2
SWDIO  (via drill 0.3)
  Top 0.152: MCU2.34 38.25,46.25 35.25,46.25 v35,46.5
  Bottom 0.152: v35,46.5 31.5,43 31.5,11.25 38.25,4.5 47.25,4.5 47.25,10 SWD.3
TX1  (via drill 0.3)
  Top 0.152: MCU2.30 40.25,43.25 v43.25,43.25 | v42.25,47 39.25,50 39.25,52.75 24.5,52.75 18.25,46.5 v16.25,46.5
  Bottom 0.152: v43.25,43.25 42.25,44.25 v42.25,47 | v16.25,46.5 16,46.25 GPS1.RD0
TX2  (via drill 0.3)
  Top 0.152: IM1.$P6 58.75,39.5 v57.5,39.5 | v57,35 56.75,35.25 43.25,35.25 MCU2.12
  Bottom 0.152: v57.5,39.5 57,39 v57,35
USBIN  (via drill 0.3)
  Top 0.381: v10.5,42.5 10,42.5 9.25,41.75 X2.1
  Bottom 0.381: D2.A 22,26 22,25 21.75,24.75 19.25,24.75 | 19.25,24.75 19.25,30 R15.2 | FET6.P$1 9.25,53 | 9.25,53 FET7.P$1 | 9.25,53 9.25,43.75 v10.5,42.5 10.5,24.75 19.25,24.75